# Altium project Brameczki.PrjPcb
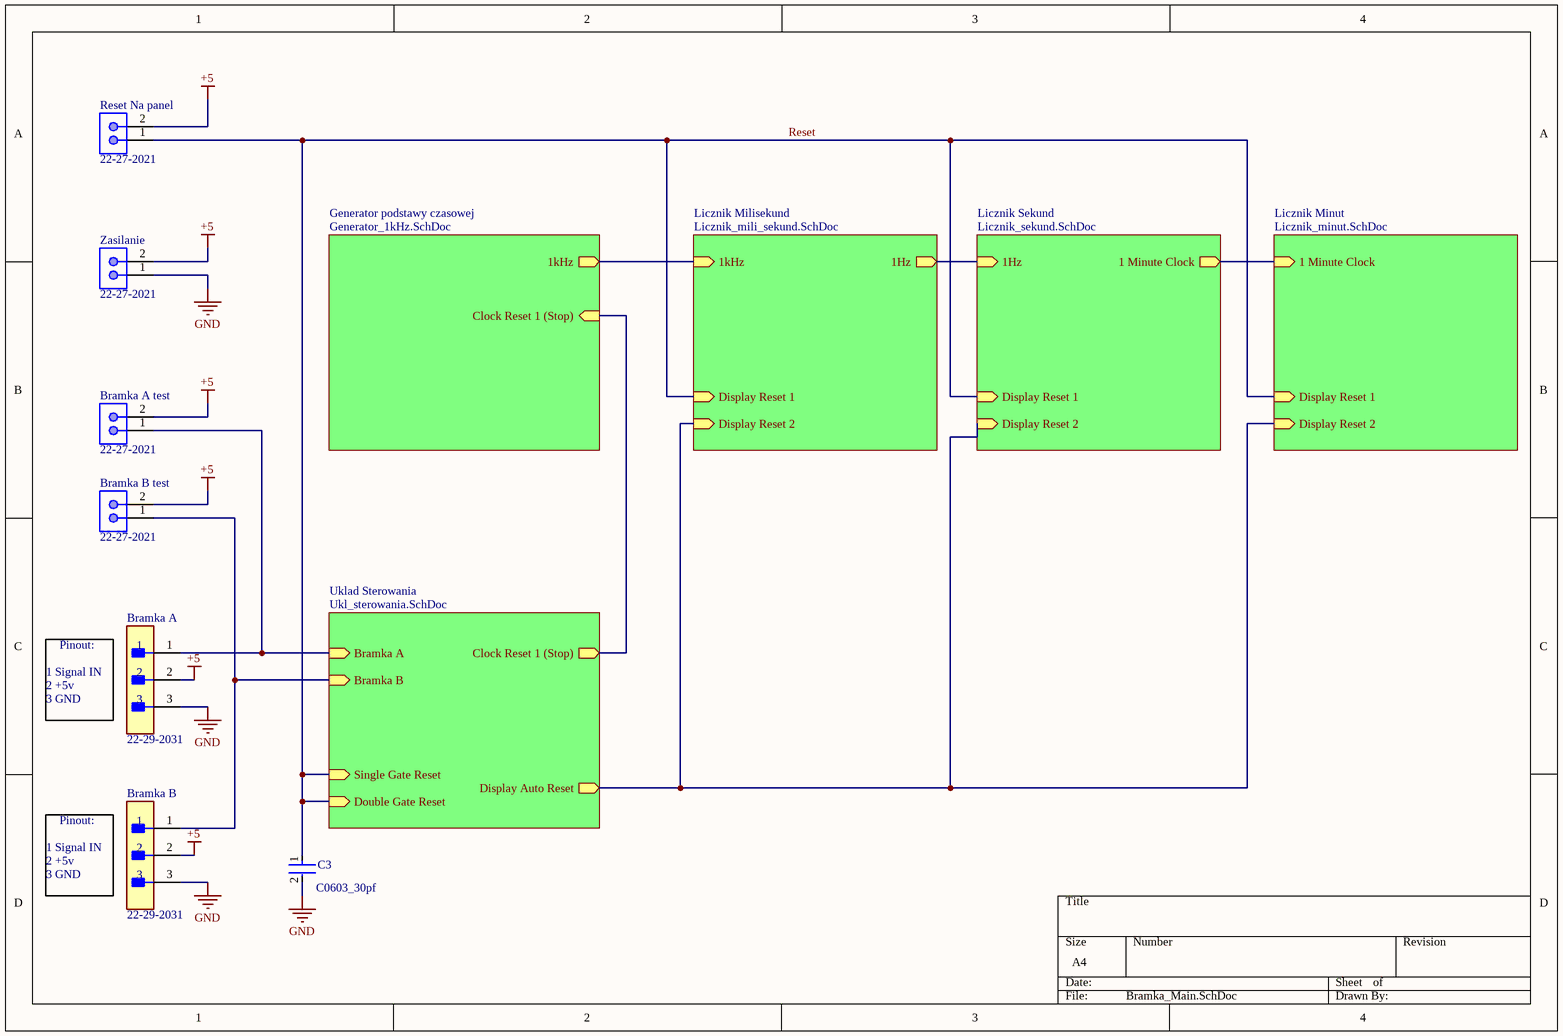
[diagram p0: Bramka_Main.SchDoc]
8 sheets, 135 parts. Net scope: hierarchical (ports join the sheet entries above them; power ports are global).
Board file: Mainboard.PcbDoc
Sheets:
  Bramka_Main.SchDoc
    Generator podstawy czasowej = Generator_1kHz.SchDoc
    Licznik Milisekund = Licznik_mili_sekund.SchDoc
    Licznik Sekund = Licznik_sekund.SchDoc
    Licznik Minut = Licznik_minut.SchDoc
    Uklad Sterowania = Ukl_sterowania.SchDoc
      SR latch = SR.SchDoc
      Uklad rozniczkujacy = Autoreset.SchDoc

## Sheet Bramka_Main.SchDoc
size A4; SheetNumber: 1; SheetTotal: 8

### Parts
Bramka_A  22-29-2031  [FP-22-29-2031-MFG]
Bramka_A_test  22-27-2021  [MOLX-22-27-2021_V]
Bramka_B  22-29-2031  [FP-22-29-2031-MFG]
Bramka_B_test  22-27-2021  [MOLX-22-27-2021_V]
C3  C0603_30pf  [FP-C0603C-CF-MFG]
Reset_Na_panel  22-27-2021  [MOLX-22-27-2021_V]
Zasilanie  22-27-2021  [MOLX-22-27-2021_V]

### Sub-sheets
Generator podstawy czasowej = Generator_1kHz.SchDoc: Clock Reset 1 (Stop) (in), 1kHz (out)
Licznik Milisekund = Licznik_mili_sekund.SchDoc: 1kHz (in), 1Hz (out), Display Reset 1 (in), Display Reset 2 (in)
Licznik Minut = Licznik_minut.SchDoc: 1 Minute Clock (in), Display Reset 1 (in), Display Reset 2 (in)
Licznik Sekund = Licznik_sekund.SchDoc: 1 Minute Clock (out), 1Hz (in), Display Reset 1 (in), Display Reset 2 (in)
Uklad Sterowania = Ukl_sterowania.SchDoc: Bramka A (in), Bramka B (in), Clock Reset 1 (Stop) (out), Single Gate Reset (in), Double Gate Reset (in), Display Auto Reset (out)

### Nets
+5: Bramka_A.2 Bramka_A_test.2 Bramka_B.2 Bramka_B_test.2 Reset_Na_panel.2 Zasilanie.2
GND: Bramka_A.3 Bramka_B.3 C3.2 Zasilanie.1
1Hz: sheet Licznik Milisekund/1Hz, sheet Licznik Sekund/1Hz
Display Reset 2: sheet Licznik Milisekund/Display Reset 2, sheet Licznik Sekund/Display Reset 2, sheet Licznik Minut/Display Reset 2, sheet Uklad Sterowania/Display Auto Reset
Reset: C3.1 Reset_Na_panel.1 ; sheet Licznik Milisekund/Display Reset 1, sheet Licznik Sekund/Display Reset 1, sheet Licznik Minut/Display Reset 1, sheet Uklad Sterowania/Single Gate Reset, sheet Uklad Sterowania/Double Gate Reset  [project net Display Reset 1]
NetBramka_A_1: Bramka_A.1 Bramka_A_test.1 ; sheet Uklad Sterowania/Bramka A
NetBramka_B_1: Bramka_B.1 Bramka_B_test.1 ; sheet Uklad Sterowania/Bramka B
NetD14_1: sheet Generator podstawy czasowej/Clock Reset 1 (Stop), sheet Uklad Sterowania/Clock Reset 1 (Stop)
NetU4_5: sheet Licznik Sekund/1 Minute Clock, sheet Licznik Minut/1 Minute Clock
NetU9_1: sheet Generator podstawy czasowej/1kHz, sheet Licznik Milisekund/1kHz

### Notes on the sheet
- (near Bramka_A) Pinout:
- (near Bramka_A) 1 Signal IN
- 2 +5v
- 3 GND
- (near Bramka_B) 1 Signal IN
- (near Bramka_B) Pinout:

### Library data of the parts
Bramka_A Bramka_B = CMP-04776-000327-1: CONN HEADER VERT 3POS 2.54MM; Contact Resistance: 10mR; Number of Positions: 3; Voltage Rating: 250V; Gender: Male; Connector Type: Male Pin; Current Rating: 4A; Packaging: Bulk; Housing Material: Nylon; Min Operating Temperature: 0°C; Color: Natural; RoHS Compliant: Yes; Housing Color: White; Number of Rows: 1; Pitch: 2.54mm; Mount: Through Hole; Fastening Type: Friction; Length: 7.62mm; Depth: 5.8mm; Contact Material: Brass; Max Operating Temperature: 75°C; Number of Contacts: 3; Contact Type: Male Pin; Working Voltage: 250V; Orientation: Straight; Lead Pitch: 2.54mm; Radiation Hardening: No; Termination: Solder; Contact Plating: Gold; Contact Mating Length: 0.295inch; Series: KK® 6410
Bramka_A_test Bramka_B_test Reset_Na_panel Zasilanie = CMP-2000-05537-1: Male Header, Pitch 2.54 mm, 1 x 2 Position, Height 11.7 mm, Tail Length 3.56 mm, 0 to 75 degC, RoHS, Bulk; Manufacturer: Molex; PartNumber: 0022272021; Current rating: 4A; Package Version: Rev. BC, 02/2012; Voltage rating: 250V; No. of Positions: 2; Pitch: 2.54mm; No. of Rows: 1; Orientation: Vertical; Operating temperature: 0°Cto+75°C; Manufacturer URL: http://www.molex.com/; Mounting Technology: ThroughHole; Housing material: Nylon(UL94V-0); Package Description: 2-Leads Header, Body 5.08 x 5.8 mm, Pitch 2.54 mm; Voltage - Max: 250V; Datasheet URL: http://www.molex.com/pdm_docs/sd/022272021_sd.pdf; Package Reference: 22-27-2021; Contact material: Tinplatedbrass; Current - Max: 4A; Datasheet Version: Rev. F, 06/2009
C3 = CMP-1035-00914-3: CAP CER 30PF 50V 5% NP0 0603; Manufacturer Part Number: C0603C300J5GACTU; Manufacturer: KEMET; Automotive Grade: Grade 1; Temperature Coefficient: 30ppm/°C; Material: Ceramic; Temperature Characteristic: C0G; Tolerance: 0.05; ComponentLink2URL: https://api.kemet.com/component-edge/download/datasheet/C0603C100J5GACAUTO.pdf; Automotive: Yes; Device Class L2: Capacitors; Device Class L1: Passive Components; Device Class L3: Ceramic Capacitors; RoHS: TRUE; Octopart: https://octopart.com/c0603c300j5gactu-kemet-199455; Lead Free: Yes; Value: 30 pF; Temperature Range High: +125°C; Category: Cap; Temperature: -55°C to +125°C; Package: C0603C-CF; Capacitance: 30 pF; Digikey Description: CAP CER 30PF 50V 5% NP0 0603; Height: 0.87mm; ComponentLink2Description: Datasheet; Temperature Range Low: -55°C; Mouser Description: Multilayer Ceramic Capacitors MLCC - SMD/SMT 50volts 30pF C0G 5%; Voltage Rating: 50 V

## Sheet Generator_1kHz.SchDoc
size A4; SheetNumber: 8; SheetTotal: 8; SPICEModelCacheNUSKXPOH: <root> / <DocumentId>NUSKXPOH</DocumentId> / <CacheFrame Number="0"> / <Model Name="xtal" Kind="CKT"> / <Text>*Generic type:crystal pkg:HC33/51 / .SUBCKT XTAL 1 2 PARAMS: FREQ=1Meg RS=750 C=13pf Q=1000 / LX 1 3 {((Q*RS)/(6.2831852*FREQ))} IC=0.5M / CX 3 4 {(1/(Q*6.2831852*FREQ*RS))} / C0 1 2 {C} / RS 4 2 {RS} / .ENDS XTAL</Text> / </Model> / </CacheFrame> / </root>
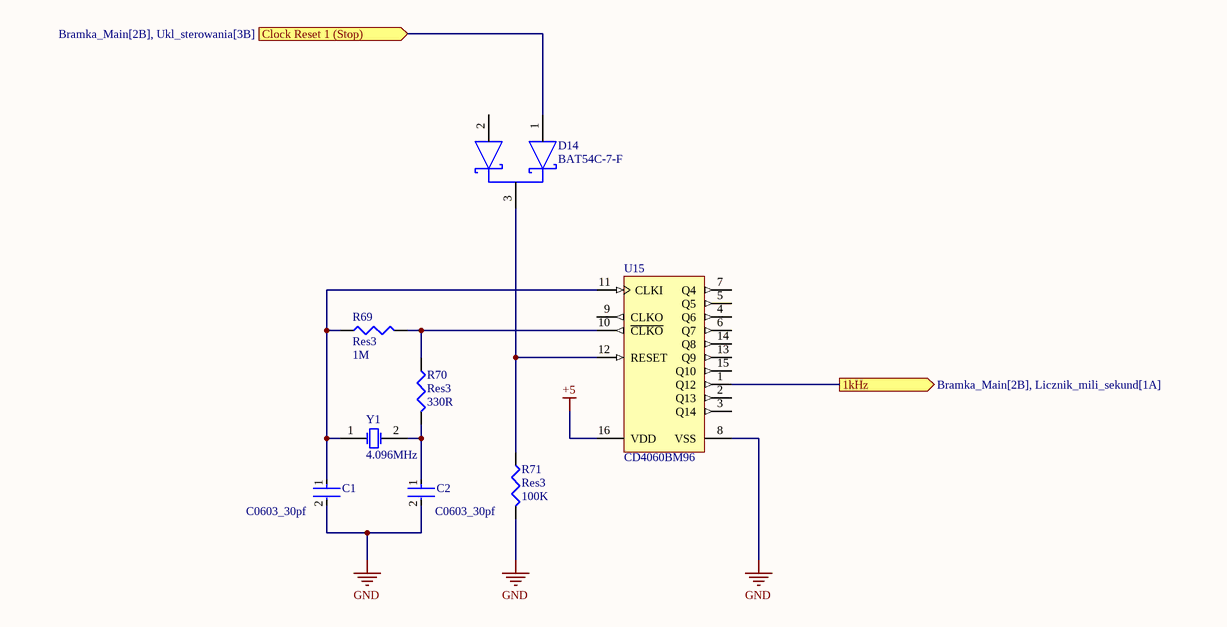
[diagram p1: Generator_1kHz.SchDoc]

### Parts
C1  C0603_30pf  [FP-C0603C-CF-MFG]
C2  C0603_30pf  [FP-C0603C-CF-MFG]
D14  BAT54C-7-F  [FP-SOT23-IPC_B]
R69  Res3  value 1M  [J1-0603]
R70  Res3  value 330R  [J1-0603]
R71  Res3  value 100K  [J1-0603]
U15  CD4060BM96  [D0016A_L]
Y1  4.096MHz  [R38]

### Ports
1kHz (out, see Bramka_Main[2B], Licznik_mili_sekund[1A]), Clock Reset 1 (Stop) (in, see Bramka_Main[2B], Ukl_sterowania[3B])

### Nets
+5: U15.16(VDD)
GND: C1.2 C2.2 R71.2 U15.8(VSS)
NetC1_1: C1.1 R69.1 U15.11(CLKI) Y1.1(OSC1)
NetC2_1: C2.1 R70.2 Y1.2(OSC2)
NetD14_1: D14.1(1_ANODE) ; port Clock Reset 1 (Stop)
NetD14_3: D14.3(COMMON_CATHODE) R71.1 U15.12(RESET)
NetR69_2: R69.2 R70.1 U15.10(~{CLKO})
NetU9_1: U15.1(Q12) ; port 1kHz

Not connected (* = marked no-connect by the designer): D14 2(2_ANODE); U15 2(Q13) 3(Q14) 4(Q6) 5(Q5) 6(Q7) 7(Q4) 9(CLKO) 13(Q9) 14(Q8) 15(Q10)

### Library data of the parts
C1 C2 = CMP-1035-00914-3: as C3 on sheet Bramka_Main; ComponentLink2URL: https://api.kemet.com/component-edge/download/datasheet/C0603C100J5GACAUTO.pdf; Automotive: Yes; Device Class L2: Capacitors; Device Class L1: Passive Components; Device Class L3: Ceramic Capacitors; RoHS: TRUE; Octopart: https://octopart.com/c0603c300j5gactu-kemet-199455; Lead Free: Yes; Value: 30 pF; Temperature Range High: +125°C; Category: Cap; Temperature: -55°C to +125°C; Package: C0603C-CF; Capacitance: 30 pF; Digikey Description: CAP CER 30PF 50V 5% NP0 0603; Height: 0.87mm; ComponentLink2Description: Datasheet; Temperature Range Low: -55°C; Mouser Description: Multilayer Ceramic Capacitors MLCC - SMD/SMT 50volts 30pF C0G 5%; Voltage Rating: 50 V
D14 = CMP-12790-000084-1: DIODE ARRAY SCHOTTKY 30V SOT23-3; Max Reverse Current: 2uA; Power Dissipation: 200mW; Average Rectified Current: 200mA; Capacitance: 10pF; Peak Non-Repetitive Surge Current: 600mA; Forward Voltage: 800mV; Reverse Recovery Time: 5ns; Element Configuration: Common Cathode; Max Operating Temperature: 150°C; Max Reverse Voltage (DC): 30V; Power Rating: 200mW; Termination: SMD/SMT; REACH SVHC: No SVHC; Voltage Rating (DC): 30V; Series: -; Current Rating: 200mA; RoHS Compliant: Yes; Max Power Dissipation: 200mW; Case/Package: SOT-23; Max Repetitive Reverse Voltage (Vrrm): 30V; Width: 1.3mm; Min Operating Temperature: -65°C; Lead Free: Lead Free; Forward Current: 200mA; Number of Pins: 3; Contact Plating: Tin; Package Quantity: 3000; Length: 2.9mm; Radiation Hardening: No; Max Forward Surge Current (Ifsm): 600mA; Height: 1mm; Packaging: Tape and Reel; Mount: Surface Mount; Weight: 0.000282oz
R69-R71 = Res3: Resistor; Published: 8-Jun-2000; LatestRevisionDate: 29-May-2009; LatestRevisionNote: IPC-7351 Footprint Added.; PackageReference: J1-0603; Publisher: Altium Limited; PackageDescription: Chip Resistor
U15 = CMP-1086-00004-4: CMOS 14-Stage Ripple Carry Binary Counter / Divider and Oscillator, 3 to 18 V, -55 to 125 degC, 16-Pin SOIC (D), Green (RoHS & no Sb/Br), Tape and Reel; Manufacturer: Texas Instruments; tPHL, tPLH (typ) @ 5 V: 370 ns; VDD: 3 to 18 V; Mounting Technology: Surface Mount; PackageReference: D0016A; ComponentLink3URL: http://www.ti.com/lit/ml/mpds178g/mpds178g.pdf; ComponentLink3Description: Package Specification; ComponentLink2URL: http://www.ti.com/lit/ds/symlink/cd4060b.pdf; PackageVersion: 4040047-6/M; PackageDescription: 16-Pin Plastic Small-Outline Package, Body 9.9 x 3.9 mm, Pitch 1.27 mm; DatasheetVersion: SCHS049C; PartNumber: CD4060BM96; ComponentLink2Description: Datasheet; Note1: Green (RoHS & no Sb/Br); ComponentLink1Description: Manufacturer URL; Temperature Range: -55 to 125 degC; Packing: Tape and Reel; ComponentLink1URL: http://www.ti.com
Y1 = XTAL: Crystal Oscillator; Published: 8-Jun-2000; LatestRevisionDate: 17-Jul-2002; LatestRevisionNote: Re-released for DXP Platform.; PackageReference: R38; Publisher: Altium Limited; PackageDescription: Crystal, Thru-Hole; 2 Leads; Body 3.1 x 8.2 mm (Dia.xH)

## Sheet Licznik_mili_sekund.SchDoc
size A4; SheetNumber: 7; SheetTotal: 8
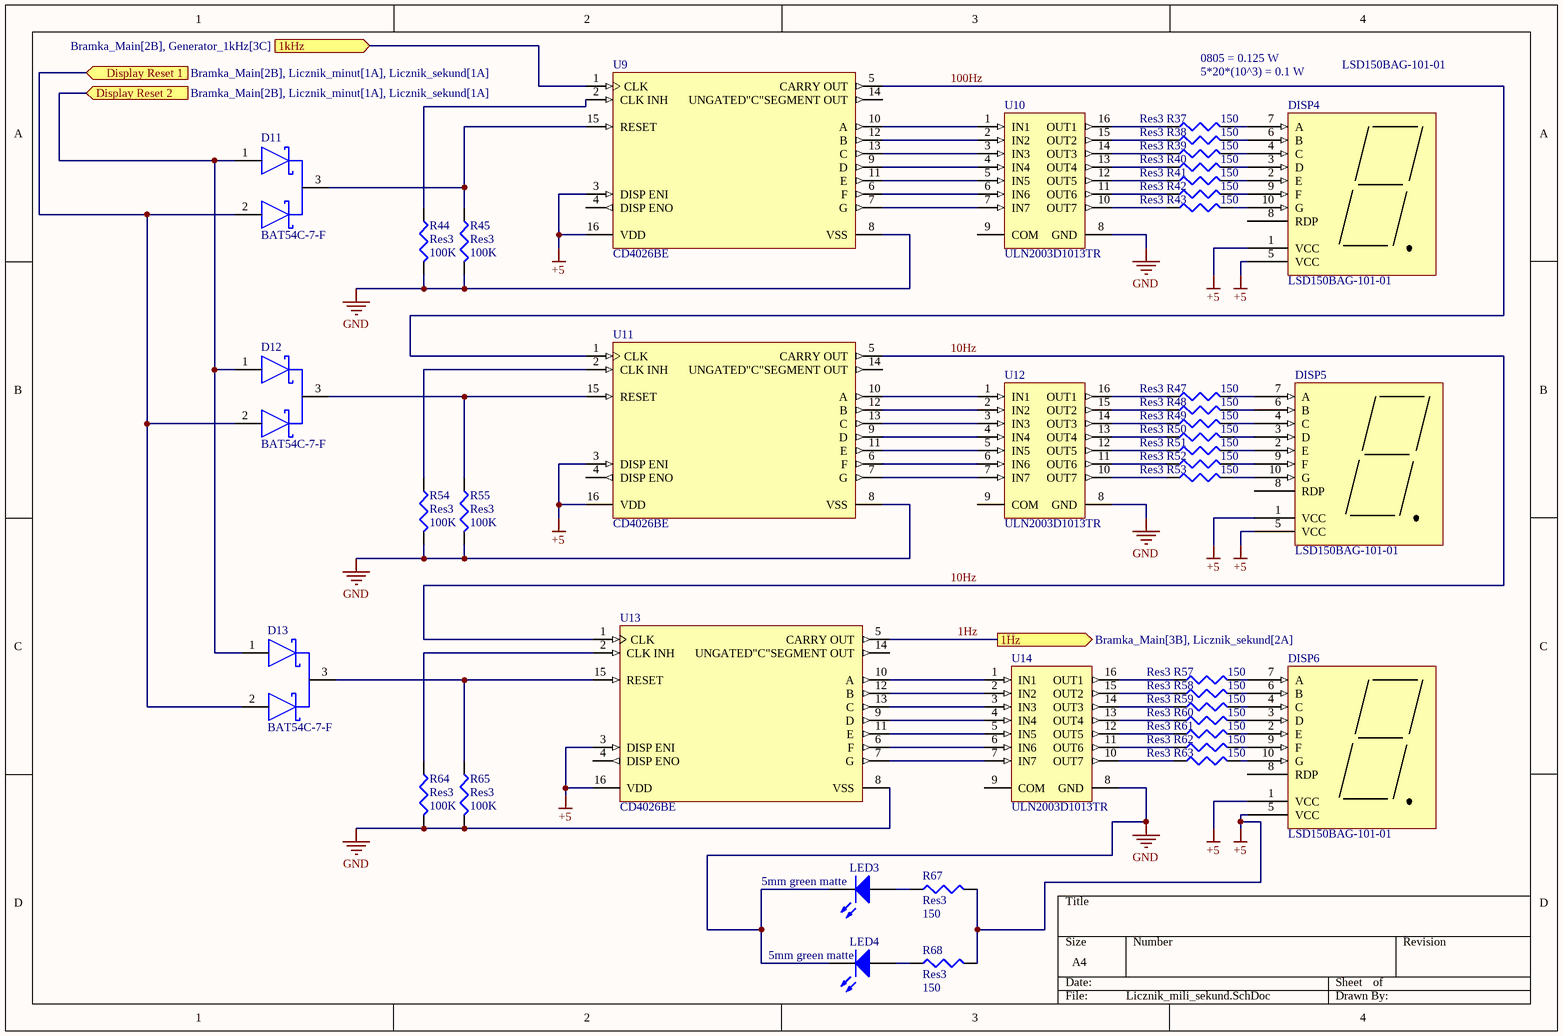
[diagram p2: Licznik_mili_sekund.SchDoc]

### Parts
D11  BAT54C-7-F  [FP-SOT23-IPC_B]
D12  BAT54C-7-F  [FP-SOT23-IPC_B]
D13  BAT54C-7-F  [FP-SOT23-IPC_B]
DISP4  LSD150BAG-101-01  [7 segment display]
DISP5  LSD150BAG-101-01  [7 segment display]
DISP6  LSD150BAG-101-01  [7 segment display]
LED3  5mm green matte  [Type 5mm]
LED4  5mm green matte  [Type 5mm]
R37  Res3  value 150  [6-0805_M]
R38  Res3  value 150  [6-0805_M]
R39  Res3  value 150  [6-0805_M]
R40  Res3  value 150  [6-0805_M]
R41  Res3  value 150  [6-0805_M]
R42  Res3  value 150  [6-0805_M]
R43  Res3  value 150  [6-0805_M]
R44  Res3  value 100K  [J1-0603]
R45  Res3  value 100K  [J1-0603]
R47  Res3  value 150  [6-0805_M]
R48  Res3  value 150  [6-0805_M]
R49  Res3  value 150  [6-0805_M]
R50  Res3  value 150  [6-0805_M]
R51  Res3  value 150  [6-0805_M]
R52  Res3  value 150  [6-0805_M]
R53  Res3  value 150  [6-0805_M]
R54  Res3  value 100K  [J1-0603]
R55  Res3  value 100K  [J1-0603]
R57  Res3  value 150  [6-0805_M]
R58  Res3  value 150  [6-0805_M]
R59  Res3  value 150  [6-0805_M]
R60  Res3  value 150  [6-0805_M]
R61  Res3  value 150  [6-0805_M]
R62  Res3  value 150  [6-0805_M]
R63  Res3  value 150  [6-0805_M]
R64  Res3  value 100K  [J1-0603]
R65  Res3  value 100K  [J1-0603]
R67  Res3  value 150  [6-0805_M]
R68  Res3  value 150  [6-0805_M]
U9  CD4026BE  [N0016A]
U10  ULN2003D1013TR  [STM-SO-16_M]
U11  CD4026BE  [N0016A]
U12  ULN2003D1013TR  [STM-SO-16_M]
U13  CD4026BE  [N0016A]
U14  ULN2003D1013TR  [STM-SO-16_M]

### Ports
1Hz (out, see Bramka_Main[3B], Licznik_sekund[2A]), 1kHz (in, see Bramka_Main[2B], Generator_1kHz[3C]), Display Reset 1 (in, see Bramka_Main[2B], Licznik_minut[1A], Licznik_sekund[1A]), Display Reset 2 (in, see Bramka_Main[2B], Licznik_minut[1A], Licznik_sekund[1A])

### Nets
+5: DISP4.1(VCC) DISP4.5(VCC) DISP5.1(VCC) DISP5.5(VCC) DISP6.1(VCC) DISP6.5(VCC) R67.2 R68.2 U9.3(DISP_ENI) U9.16(VDD) U11.3(DISP_ENI) U11.16(VDD) U13.3(DISP_ENI) U13.16(VDD)
GND: LED3.1(K) LED4.1(K) R44.2 R45.2 R54.2 R55.2 R64.2 R65.2 U9.8(VSS) U10.8(GND) U11.8(VSS) U12.8(GND) U13.8(VSS) U14.8(GND)
1Hz: U13.5(CARRY_OUT) ; port 1Hz
10Hz: U11.5(CARRY_OUT) U13.1(CLK)
100Hz: U9.5(CARRY_OUT) U11.1(CLK)
Display Reset 1: D11.2(2_ANODE) D12.2(2_ANODE) D13.2(2_ANODE) ; port Display Reset 1
Display Reset 2: D11.1(1_ANODE) D12.1(1_ANODE) D13.1(1_ANODE) ; port Display Reset 2
NetD11_3: D11.3(COMMON_CATHODE) R45.1 U9.15(RESET)
NetD12_3: D12.3(COMMON_CATHODE) R55.1 U11.15(RESET)
NetD13_3: D13.3(COMMON_CATHODE) R65.1 U13.15(RESET)
NetDISP4_2: DISP4.2(E) R41.2
NetDISP4_3: DISP4.3(D) R40.2
NetDISP4_4: DISP4.4(C) R39.2
NetDISP4_6: DISP4.6(B) R38.2
NetDISP4_7: DISP4.7(A) R37.2
NetDISP4_9: DISP4.9(F) R42.2
NetDISP4_10: DISP4.10(G) R43.2
NetDISP5_2: DISP5.2(E) R51.2
NetDISP5_3: DISP5.3(D) R50.2
NetDISP5_4: DISP5.4(C) R49.2
NetDISP5_6: DISP5.6(B) R48.2
NetDISP5_7: DISP5.7(A) R47.2
NetDISP5_9: DISP5.9(F) R52.2
NetDISP5_10: DISP5.10(G) R53.2
NetDISP6_2: DISP6.2(E) R61.2
NetDISP6_3: DISP6.3(D) R60.2
NetDISP6_4: DISP6.4(C) R59.2
NetDISP6_6: DISP6.6(B) R58.2
NetDISP6_7: DISP6.7(A) R57.2
NetDISP6_9: DISP6.9(F) R62.2
NetDISP6_10: DISP6.10(G) R63.2
NetLED3_2: LED3.2(A) R67.1
NetLED4_2: LED4.2(A) R68.1
NetR37_1: R37.1 U10.16(OUT1)
NetR38_1: R38.1 U10.15(OUT2)
NetR39_1: R39.1 U10.14(OUT3)
NetR40_1: R40.1 U10.13(OUT4)
NetR41_1: R41.1 U10.12(OUT5)
NetR42_1: R42.1 U10.11(OUT6)
NetR43_1: R43.1 U10.10(OUT7)
NetR44_1: R44.1 U9.2(CLK_INH)
NetR47_1: R47.1 U12.16(OUT1)
NetR48_1: R48.1 U12.15(OUT2)
NetR49_1: R49.1 U12.14(OUT3)
NetR50_1: R50.1 U12.13(OUT4)
NetR51_1: R51.1 U12.12(OUT5)
NetR52_1: R52.1 U12.11(OUT6)
NetR53_1: R53.1 U12.10(OUT7)
NetR54_1: R54.1 U11.2(CLK_INH)
NetR57_1: R57.1 U14.16(OUT1)
NetR58_1: R58.1 U14.15(OUT2)
NetR59_1: R59.1 U14.14(OUT3)
NetR60_1: R60.1 U14.13(OUT4)
NetR61_1: R61.1 U14.12(OUT5)
NetR62_1: R62.1 U14.11(OUT6)
NetR63_1: R63.1 U14.10(OUT7)
NetR64_1: R64.1 U13.2(CLK_INH)
NetU9_1: U9.1(CLK) ; port 1kHz
NetU9_6: U9.6(F) U10.6(IN6)
NetU9_7: U9.7(G) U10.7(IN7)
NetU9_9: U9.9(D) U10.4(IN4)
NetU9_10: U9.10(A) U10.1(IN1)
NetU9_11: U9.11(E) U10.5(IN5)
NetU9_12: U9.12(B) U10.2(IN2)
NetU9_13: U9.13(C) U10.3(IN3)
NetU11_6: U11.6(F) U12.6(IN6)
NetU11_7: U11.7(G) U12.7(IN7)
NetU11_9: U11.9(D) U12.4(IN4)
NetU11_10: U11.10(A) U12.1(IN1)
NetU11_11: U11.11(E) U12.5(IN5)
NetU11_12: U11.12(B) U12.2(IN2)
NetU11_13: U11.13(C) U12.3(IN3)
NetU13_6: U13.6(F) U14.6(IN6)
NetU13_7: U13.7(G) U14.7(IN7)
NetU13_9: U13.9(D) U14.4(IN4)
NetU13_10: U13.10(A) U14.1(IN1)
NetU13_11: U13.11(E) U14.5(IN5)
NetU13_12: U13.12(B) U14.2(IN2)
NetU13_13: U13.13(C) U14.3(IN3)

Not connected (* = marked no-connect by the designer): DISP4 8(RDP); DISP5 8(RDP); DISP6 8(RDP); U9 4(DISP_ENO) 14(UNGATED"C"SEGMENT_OUT); U10 9(COM); U11 4(DISP_ENO) 14(UNGATED"C"SEGMENT_OUT); U12 9(COM); U13 4(DISP_ENO) 14(UNGATED"C"SEGMENT_OUT); U14 9(COM)

### Notes on the sheet
- 5*20*(10^3) = 0.1 W
- 0805 = 0.125 W
- LSD150BAG-101-01

### Library data of the parts
D11-D13 = CMP-12790-000084-1: as D14 on sheet Generator_1kHz; Max Operating Temperature: 150°C; Max Reverse Voltage (DC): 30V; Power Rating: 200mW; Termination: SMD/SMT; REACH SVHC: No SVHC; Voltage Rating (DC): 30V; Series: -; Current Rating: 200mA; RoHS Compliant: Yes; Max Power Dissipation: 200mW; Case/Package: SOT-23; Max Repetitive Reverse Voltage (Vrrm): 30V; Width: 1.3mm; Min Operating Temperature: -65°C; Lead Free: Lead Free; Forward Current: 200mA; Number of Pins: 3; Contact Plating: Tin; Package Quantity: 3000; Length: 2.9mm; Radiation Hardening: No; Max Forward Surge Current (Ifsm): 600mA; Height: 1mm; Packaging: Tape and Reel; Mount: Surface Mount; Weight: 0.000282oz
DISP4-DISP6 = CMP-007-00036-2: 7 segment display 1.5 inch
LED3 LED4 = CMP-1488-00007-1: THT LED round mono-color color lens, WL-TMRW, Bright Green; PartNumber: 151051VS04000; Manufacturer: Wuerth Elektronik; Emitting color: Bright Green; ComponentLink1Description: Manufacturer URL; PackageReference: Type 5mm; ComponentLink2URL: http://katalog.we-online.de/pbs/datasheet/7448042001.pdfhttp://katalog.we-online.de/pbs/datasheet/7448042001.pdfhttp://katalog.we-online.de/pbs/datasheet/7448042001.pdfhttp://katalog.we-online.de/pbs/datasheet/151051VS04000.pdf; ComponentLink1URL: http://www.we-online.com; ComponentLink2Description: Datasheet
R37-R45 R47-R55 R57-R65 R67 R68 = Res3: Resistor; Published: 8-Jun-2000; LatestRevisionDate: 29-May-2009; LatestRevisionNote: IPC-7351 Footprint Added.; PackageReference: J1-0603; Publisher: Altium Limited; PackageDescription: Chip Resistor
U9 U11 U13 = CMP-1623-00561-2: CMOS Decade Counter/Divider with Decoded 7-Segment Display Outputs and Display Enable, N0016A, TUBE; Manufacturer: Texas Instruments; ICC @ Nom Voltage(Max)(mA): 0.03; tpd @ Nom Voltage(Max)(ns): 250; F @ Nom Voltage(Max)(Mhz): 8; Bits(#): 7; VCC(Max)(V): 18; VCC(Min)(V): 3; Output Drive (IOL/IOH)(Max)(mA): 1.5/-1.5; Inputs: 1; Rating: Catalog; Technology Family: CD4000; Schmitt Trigger: No; Voltage(Nom)(V): 5,10,15; DatasheetVersion: SCHS031B; Operating Temperature Range(C): -55 to 125; Code_JEDEC: MS-001; Input Type: CMOS; Output Type: CMOS; Type: Decade; Generic Part Number: CD4026B; PackageReference: N0016A; Function: Counter
U10 U12 U14 = CMP-2000-05374-1: Seven NPN Darlington Array Transistor, 50 V, 500 mA, -40 to 85 degC, 8-Pin SOIC, RoHS, Tape and Reel; Manufacturer: STMicroelectronics; Collector Emitter Voltage V(br)ceo: 50V; SVHC: NoSVHC(17-Dec-2015); DC Current Gain hFE: 1000hFE; DC Collector Current: 500mA; No. of Pins: 16Pins; Package Reference: SO-16; Transistor Polarity: NPN; Transistor Case Style: SOIC; Datasheet URL: https://datasheet.ciiva.com/1193/1690348-1193460.pdf; Package Description: 16-Pin Small Outline Integrated Circuit, Body 9.9 x 3.9 mm, Pitch 1.27 mm; Datasheet Version: Rev. 8, 06/2012; Power Dissipation Pd: -; Product Range: -; Operating Temperature Max: 85degC; MSL: MSL1-Unlimited; Manufacturer URL: http://www.st.com/; Automotive Qualification Standard: -

## Sheet Licznik_sekund.SchDoc
size A4; SheetNumber: 2; SheetTotal: 8
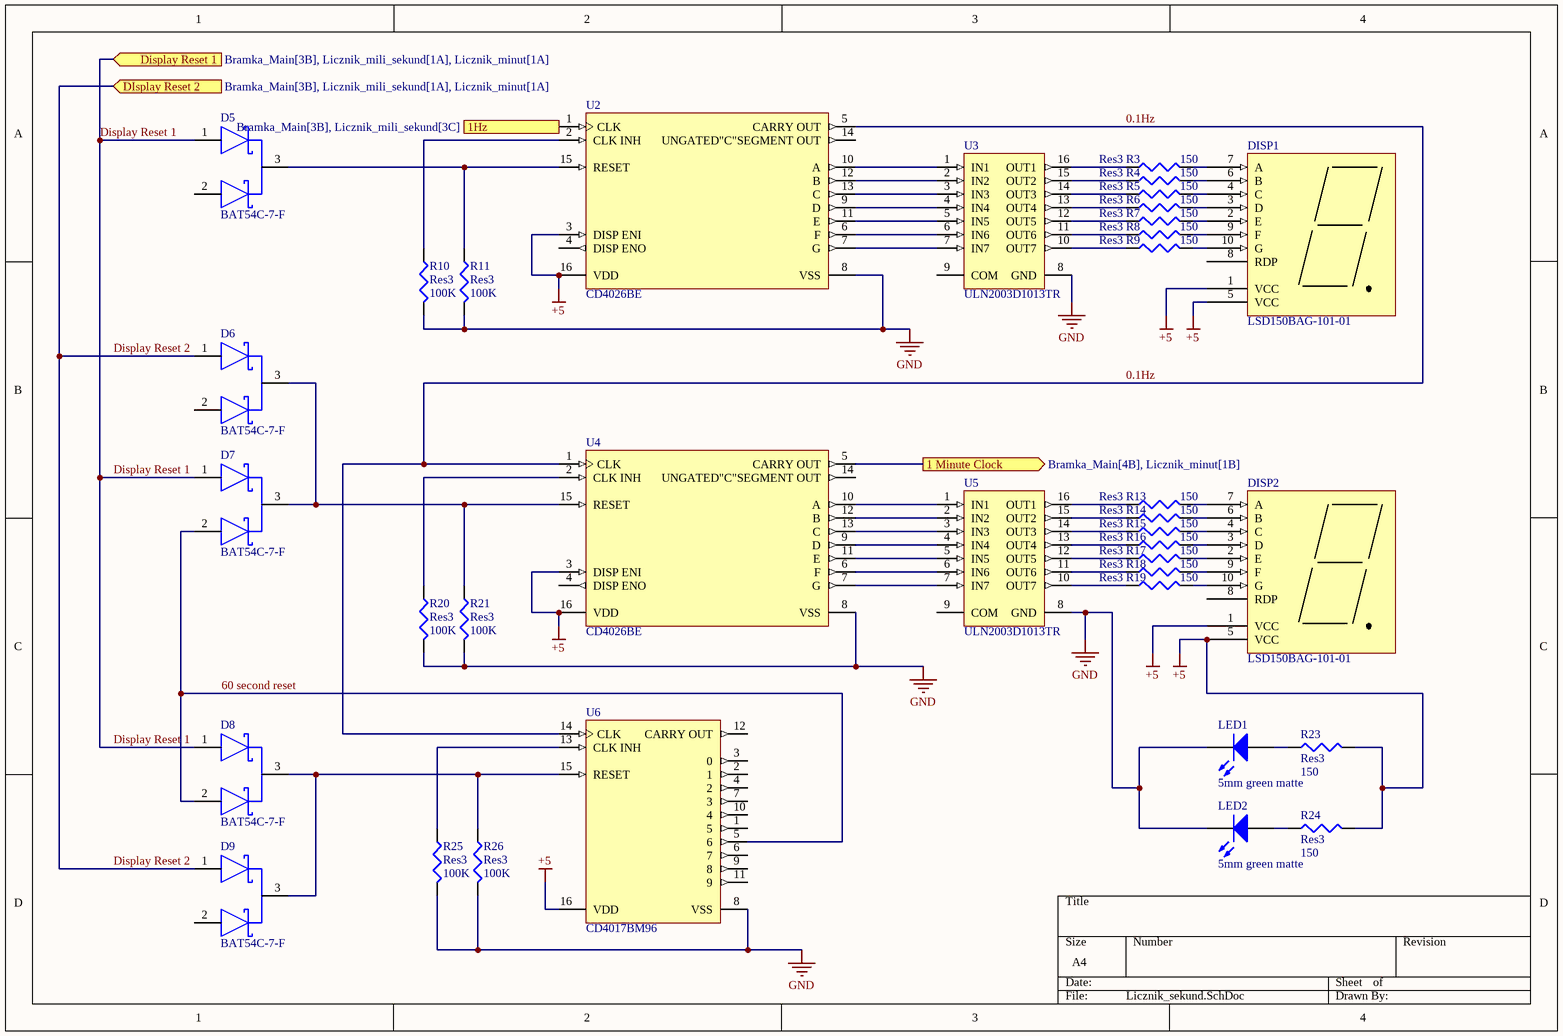
[diagram p3: Licznik_sekund.SchDoc]

### Parts
D5  BAT54C-7-F  [FP-SOT23-IPC_B]
D6  BAT54C-7-F  [FP-SOT23-IPC_B]
D7  BAT54C-7-F  [FP-SOT23-IPC_B]
D8  BAT54C-7-F  [FP-SOT23-IPC_B]
D9  BAT54C-7-F  [FP-SOT23-IPC_B]
DISP1  LSD150BAG-101-01  [7 segment display]
DISP2  LSD150BAG-101-01  [7 segment display]
LED1  5mm green matte  [Type 5mm]
LED2  5mm green matte  [Type 5mm]
R3  Res3  value 150  [6-0805_M]
R4  Res3  value 150  [6-0805_M]
R5  Res3  value 150  [6-0805_M]
R6  Res3  value 150  [6-0805_M]
R7  Res3  value 150  [6-0805_M]
R8  Res3  value 150  [6-0805_M]
R9  Res3  value 150  [6-0805_M]
R10  Res3  value 100K  [J1-0603]
R11  Res3  value 100K  [J1-0603]
R13  Res3  value 150  [6-0805_M]
R14  Res3  value 150  [6-0805_M]
R15  Res3  value 150  [6-0805_M]
R16  Res3  value 150  [6-0805_M]
R17  Res3  value 150  [6-0805_M]
R18  Res3  value 150  [6-0805_M]
R19  Res3  value 150  [6-0805_M]
R20  Res3  value 100K  [J1-0603]
R21  Res3  value 100K  [J1-0603]
R23  Res3  value 150  [6-0805_M]
R24  Res3  value 150  [6-0805_M]
R25  Res3  value 100K  [J1-0603]
R26  Res3  value 100K  [J1-0603]
U2  CD4026BE  [N0016A]
U3  ULN2003D1013TR  [STM-SO-16_M]
U4  CD4026BE  [N0016A]
U5  ULN2003D1013TR  [STM-SO-16_M]
U6  CD4017BM96  [D0016A_L]

### Ports
1 Minute Clock (out, see Bramka_Main[4B], Licznik_minut[1B]), 1Hz (in, see Bramka_Main[3B], Licznik_mili_sekund[3C]), Display Reset 1 (in, see Bramka_Main[3B], Licznik_mili_sekund[1A], Licznik_minut[1A]), DIsplay Reset 2 (in, see Bramka_Main[3B], Licznik_mili_sekund[1A], Licznik_minut[1A])

### Nets
+5: DISP1.1(VCC) DISP1.5(VCC) DISP2.1(VCC) DISP2.5(VCC) R23.2 R24.2 U2.3(DISP_ENI) U2.16(VDD) U4.3(DISP_ENI) U4.16(VDD) U6.16(VDD)
GND: LED1.1(K) LED2.1(K) R10.2 R11.2 R20.2 R21.2 R25.2 R26.2 U2.8(VSS) U3.8(GND) U4.8(VSS) U5.8(GND) U6.8(VSS)
0.1Hz: U2.5(CARRY_OUT) U4.1(CLK) U6.14(CLK)
1Hz: U2.1(CLK) ; port 1Hz
60 second reset: D7.2(2_ANODE) D8.2(2_ANODE) U6.5(6)
Display Reset 1: D5.1(1_ANODE) D7.1(1_ANODE) D8.1(1_ANODE) ; port Display Reset 1
Display Reset 2: D6.1(1_ANODE) D9.1(1_ANODE) ; port DIsplay Reset 2
NetD5_3: D5.3(COMMON_CATHODE) R11.1 U2.15(RESET)
NetD6_3: D6.3(COMMON_CATHODE) D7.3(COMMON_CATHODE) R21.1 U4.15(RESET)
NetD8_3: D8.3(COMMON_CATHODE) D9.3(COMMON_CATHODE) R26.1 U6.15(RESET)
NetDISP1_2: DISP1.2(E) R7.2
NetDISP1_3: DISP1.3(D) R6.2
NetDISP1_4: DISP1.4(C) R5.2
NetDISP1_6: DISP1.6(B) R4.2
NetDISP1_7: DISP1.7(A) R3.2
NetDISP1_9: DISP1.9(F) R8.2
NetDISP1_10: DISP1.10(G) R9.2
NetDISP2_2: DISP2.2(E) R17.2
NetDISP2_3: DISP2.3(D) R16.2
NetDISP2_4: DISP2.4(C) R15.2
NetDISP2_6: DISP2.6(B) R14.2
NetDISP2_7: DISP2.7(A) R13.2
NetDISP2_9: DISP2.9(F) R18.2
NetDISP2_10: DISP2.10(G) R19.2
NetLED1_2: LED1.2(A) R23.1
NetLED2_2: LED2.2(A) R24.1
NetR3_1: R3.1 U3.16(OUT1)
NetR4_1: R4.1 U3.15(OUT2)
NetR5_1: R5.1 U3.14(OUT3)
NetR6_1: R6.1 U3.13(OUT4)
NetR7_1: R7.1 U3.12(OUT5)
NetR8_1: R8.1 U3.11(OUT6)
NetR9_1: R9.1 U3.10(OUT7)
NetR10_1: R10.1 U2.2(CLK_INH)
NetR13_1: R13.1 U5.16(OUT1)
NetR14_1: R14.1 U5.15(OUT2)
NetR15_1: R15.1 U5.14(OUT3)
NetR16_1: R16.1 U5.13(OUT4)
NetR17_1: R17.1 U5.12(OUT5)
NetR18_1: R18.1 U5.11(OUT6)
NetR19_1: R19.1 U5.10(OUT7)
NetR20_1: R20.1 U4.2(CLK_INH)
NetR25_1: R25.1 U6.13(CLK_INH)
NetU2_6: U2.6(F) U3.6(IN6)
NetU2_7: U2.7(G) U3.7(IN7)
NetU2_9: U2.9(D) U3.4(IN4)
NetU2_10: U2.10(A) U3.1(IN1)
NetU2_11: U2.11(E) U3.5(IN5)
NetU2_12: U2.12(B) U3.2(IN2)
NetU2_13: U2.13(C) U3.3(IN3)
NetU4_5: U4.5(CARRY_OUT) ; port 1 Minute Clock
NetU4_6: U4.6(F) U5.6(IN6)
NetU4_7: U4.7(G) U5.7(IN7)
NetU4_9: U4.9(D) U5.4(IN4)
NetU4_10: U4.10(A) U5.1(IN1)
NetU4_11: U4.11(E) U5.5(IN5)
NetU4_12: U4.12(B) U5.2(IN2)
NetU4_13: U4.13(C) U5.3(IN3)

Not connected (* = marked no-connect by the designer): D5 2(2_ANODE); D6 2(2_ANODE); D9 2(2_ANODE); DISP1 8(RDP); DISP2 8(RDP); U2 4(DISP_ENO) 14(UNGATED"C"SEGMENT_OUT); U3 9(COM); U4 4(DISP_ENO) 14(UNGATED"C"SEGMENT_OUT); U5 9(COM); U6 1(5) 2(1) 3(0) 4(2) 6(7) 7(3) 9(8) 10(4) 11(9) 12(CARRY_OUT)

### Library data of the parts
D5-D9 = CMP-12790-000084-1: as D14 on sheet Generator_1kHz; Max Operating Temperature: 150°C; Max Reverse Voltage (DC): 30V; Power Rating: 200mW; Termination: SMD/SMT; REACH SVHC: No SVHC; Voltage Rating (DC): 30V; Series: -; Current Rating: 200mA; RoHS Compliant: Yes; Max Power Dissipation: 200mW; Case/Package: SOT-23; Max Repetitive Reverse Voltage (Vrrm): 30V; Width: 1.3mm; Min Operating Temperature: -65°C; Lead Free: Lead Free; Forward Current: 200mA; Number of Pins: 3; Contact Plating: Tin; Package Quantity: 3000; Length: 2.9mm; Radiation Hardening: No; Max Forward Surge Current (Ifsm): 600mA; Height: 1mm; Packaging: Tape and Reel; Mount: Surface Mount; Weight: 0.000282oz
DISP1 DISP2 = CMP-007-00036-2: 7 segment display 1.5 inch
LED1 LED2 = CMP-1488-00007-1: as LED3 on sheet Licznik_mili_sekund; Emitting color: Bright Green; ComponentLink1Description: Manufacturer URL; PackageReference: Type 5mm; ComponentLink2URL: http://katalog.we-online.de/pbs/datasheet/7448042001.pdfhttp://katalog.we-online.de/pbs/datasheet/7448042001.pdfhttp://katalog.we-online.de/pbs/datasheet/7448042001.pdfhttp://katalog.we-online.de/pbs/datasheet/151051VS04000.pdf; ComponentLink1URL: http://www.we-online.com; ComponentLink2Description: Datasheet
R3-R11 R13-R21 R23-R26 = Res3: Resistor; Published: 8-Jun-2000; LatestRevisionDate: 29-May-2009; LatestRevisionNote: IPC-7351 Footprint Added.; PackageReference: J1-0603; Publisher: Altium Limited; PackageDescription: Chip Resistor
U2 U4 = CMP-1623-00561-2: as U9 on sheet Licznik_mili_sekund; DatasheetVersion: SCHS031B; Operating Temperature Range(C): -55 to 125; Code_JEDEC: MS-001; Input Type: CMOS; Output Type: CMOS; Type: Decade; Generic Part Number: CD4026B; PackageReference: N0016A; Function: Counter
U3 U5 = CMP-2000-05374-1: as U10 on sheet Licznik_mili_sekund; Package Reference: SO-16; Transistor Polarity: NPN; Transistor Case Style: SOIC; Datasheet URL: https://datasheet.ciiva.com/1193/1690348-1193460.pdf; Package Description: 16-Pin Small Outline Integrated Circuit, Body 9.9 x 3.9 mm, Pitch 1.27 mm; Datasheet Version: Rev. 8, 06/2012; Power Dissipation Pd: -; Product Range: -; Operating Temperature Max: 85degC; MSL: MSL1-Unlimited; Manufacturer URL: http://www.st.com/; Automotive Qualification Standard: -
U6 = CMP-1623-00072-2: CMOS Decade Counter with 10 Decoded Outputs, D0016A, LARGE T&R; Manufacturer: Texas Instruments; Technology Family: CD4000; Schmitt Trigger: No; VCC(Max)(V): 18; Inputs: 1; tpd @ Nom Voltage(Max)(ns): 270; Rating: Military; Bits(#): 10; Output Drive (IOL/IOH)(Max)(mA): 1.5/-1.5; ICC @ Nom Voltage(Max)(mA): 0.03; F @ Nom Voltage(Max)(Mhz): 8; VCC(Min)(V): 3; Output Type: CMOS; Operating Temperature Range(C): -55 to 125; Generic Part Number: CD4017B; Type: Decade; DatasheetVersion: SCHS027C; Input Type: CMOS; Function: Counter; PackageReference: D0016A; Code_JEDEC: MS-012 variation AC; Voltage(Nom)(V): 10

## Sheet Licznik_minut.SchDoc
size A4; SheetNumber: 3; SheetTotal: 8
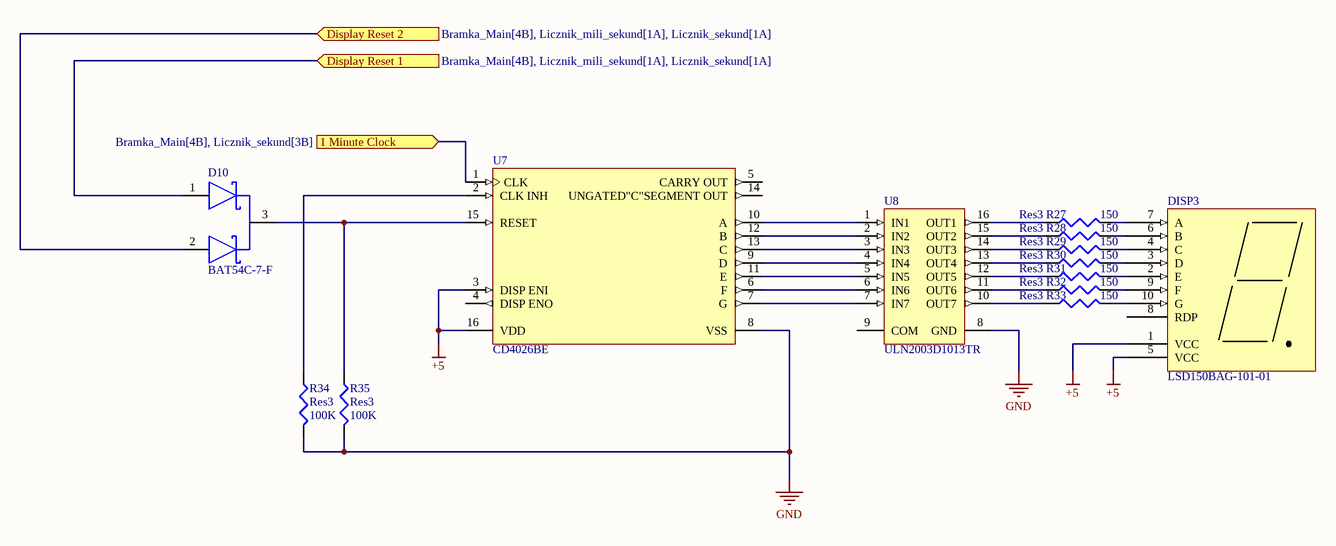
[diagram p4: Licznik_minut.SchDoc]

### Parts
D10  BAT54C-7-F  [FP-SOT23-IPC_B]
DISP3  LSD150BAG-101-01  [7 segment display]
R27  Res3  value 150  [6-0805_M]
R28  Res3  value 150  [6-0805_M]
R29  Res3  value 150  [6-0805_M]
R30  Res3  value 150  [6-0805_M]
R31  Res3  value 150  [6-0805_M]
R32  Res3  value 150  [6-0805_M]
R33  Res3  value 150  [6-0805_M]
R34  Res3  value 100K  [J1-0603]
R35  Res3  value 100K  [J1-0603]
U7  CD4026BE  [N0016A]
U8  ULN2003D1013TR  [STM-SO-16_M]

### Ports
1 Minute Clock (in, see Bramka_Main[4B], Licznik_sekund[3B]), Display Reset 1 (in, see Bramka_Main[4B], Licznik_mili_sekund[1A], Licznik_sekund[1A]), Display Reset 2 (in, see Bramka_Main[4B], Licznik_mili_sekund[1A], Licznik_sekund[1A])

### Nets
+5: DISP3.1(VCC) DISP3.5(VCC) U7.3(DISP_ENI) U7.16(VDD)
GND: R34.2 R35.2 U7.8(VSS) U8.8(GND)
Display Reset 1: D10.1(1_ANODE) ; port Display Reset 1
Display Reset 2: D10.2(2_ANODE) ; port Display Reset 2
NetD10_3: D10.3(COMMON_CATHODE) R35.1 U7.15(RESET)
NetDISP3_2: DISP3.2(E) R31.2
NetDISP3_3: DISP3.3(D) R30.2
NetDISP3_4: DISP3.4(C) R29.2
NetDISP3_6: DISP3.6(B) R28.2
NetDISP3_7: DISP3.7(A) R27.2
NetDISP3_9: DISP3.9(F) R32.2
NetDISP3_10: DISP3.10(G) R33.2
NetR27_1: R27.1 U8.16(OUT1)
NetR28_1: R28.1 U8.15(OUT2)
NetR29_1: R29.1 U8.14(OUT3)
NetR30_1: R30.1 U8.13(OUT4)
NetR31_1: R31.1 U8.12(OUT5)
NetR32_1: R32.1 U8.11(OUT6)
NetR33_1: R33.1 U8.10(OUT7)
NetR34_1: R34.1 U7.2(CLK_INH)
NetU4_5: U7.1(CLK) ; port 1 Minute Clock
NetU7_6: U7.6(F) U8.6(IN6)
NetU7_7: U7.7(G) U8.7(IN7)
NetU7_9: U7.9(D) U8.4(IN4)
NetU7_10: U7.10(A) U8.1(IN1)
NetU7_11: U7.11(E) U8.5(IN5)
NetU7_12: U7.12(B) U8.2(IN2)
NetU7_13: U7.13(C) U8.3(IN3)

Not connected (* = marked no-connect by the designer): DISP3 8(RDP); U7 4(DISP_ENO) 5(CARRY_OUT) 14(UNGATED"C"SEGMENT_OUT); U8 9(COM)

### Library data of the parts
D10 = CMP-12790-000084-1: as D14 on sheet Generator_1kHz; Max Operating Temperature: 150°C; Max Reverse Voltage (DC): 30V; Power Rating: 200mW; Termination: SMD/SMT; REACH SVHC: No SVHC; Voltage Rating (DC): 30V; Series: -; Current Rating: 200mA; RoHS Compliant: Yes; Max Power Dissipation: 200mW; Case/Package: SOT-23; Max Repetitive Reverse Voltage (Vrrm): 30V; Width: 1.3mm; Min Operating Temperature: -65°C; Lead Free: Lead Free; Forward Current: 200mA; Number of Pins: 3; Contact Plating: Tin; Package Quantity: 3000; Length: 2.9mm; Radiation Hardening: No; Max Forward Surge Current (Ifsm): 600mA; Height: 1mm; Packaging: Tape and Reel; Mount: Surface Mount; Weight: 0.000282oz
DISP3 = CMP-007-00036-2: 7 segment display 1.5 inch
R27-R35 = Res3: Resistor; Published: 8-Jun-2000; LatestRevisionDate: 29-May-2009; LatestRevisionNote: IPC-7351 Footprint Added.; PackageReference: J1-0603; Publisher: Altium Limited; PackageDescription: Chip Resistor
U7 = CMP-1623-00561-2: as U9 on sheet Licznik_mili_sekund; DatasheetVersion: SCHS031B; Operating Temperature Range(C): -55 to 125; Code_JEDEC: MS-001; Input Type: CMOS; Output Type: CMOS; Type: Decade; Generic Part Number: CD4026B; PackageReference: N0016A; Function: Counter
U8 = CMP-2000-05374-1: as U10 on sheet Licznik_mili_sekund; Package Reference: SO-16; Transistor Polarity: NPN; Transistor Case Style: SOIC; Datasheet URL: https://datasheet.ciiva.com/1193/1690348-1193460.pdf; Package Description: 16-Pin Small Outline Integrated Circuit, Body 9.9 x 3.9 mm, Pitch 1.27 mm; Datasheet Version: Rev. 8, 06/2012; Power Dissipation Pd: -; Product Range: -; Operating Temperature Max: 85degC; MSL: MSL1-Unlimited; Manufacturer URL: http://www.st.com/; Automotive Qualification Standard: -

## Sheet Ukl_sterowania.SchDoc
size A4; SheetNumber: 4; SheetTotal: 8; SPICEModelCacheXNHIIHBZ: <root> / <DocumentId>XNHIIHBZ</DocumentId> / </root>
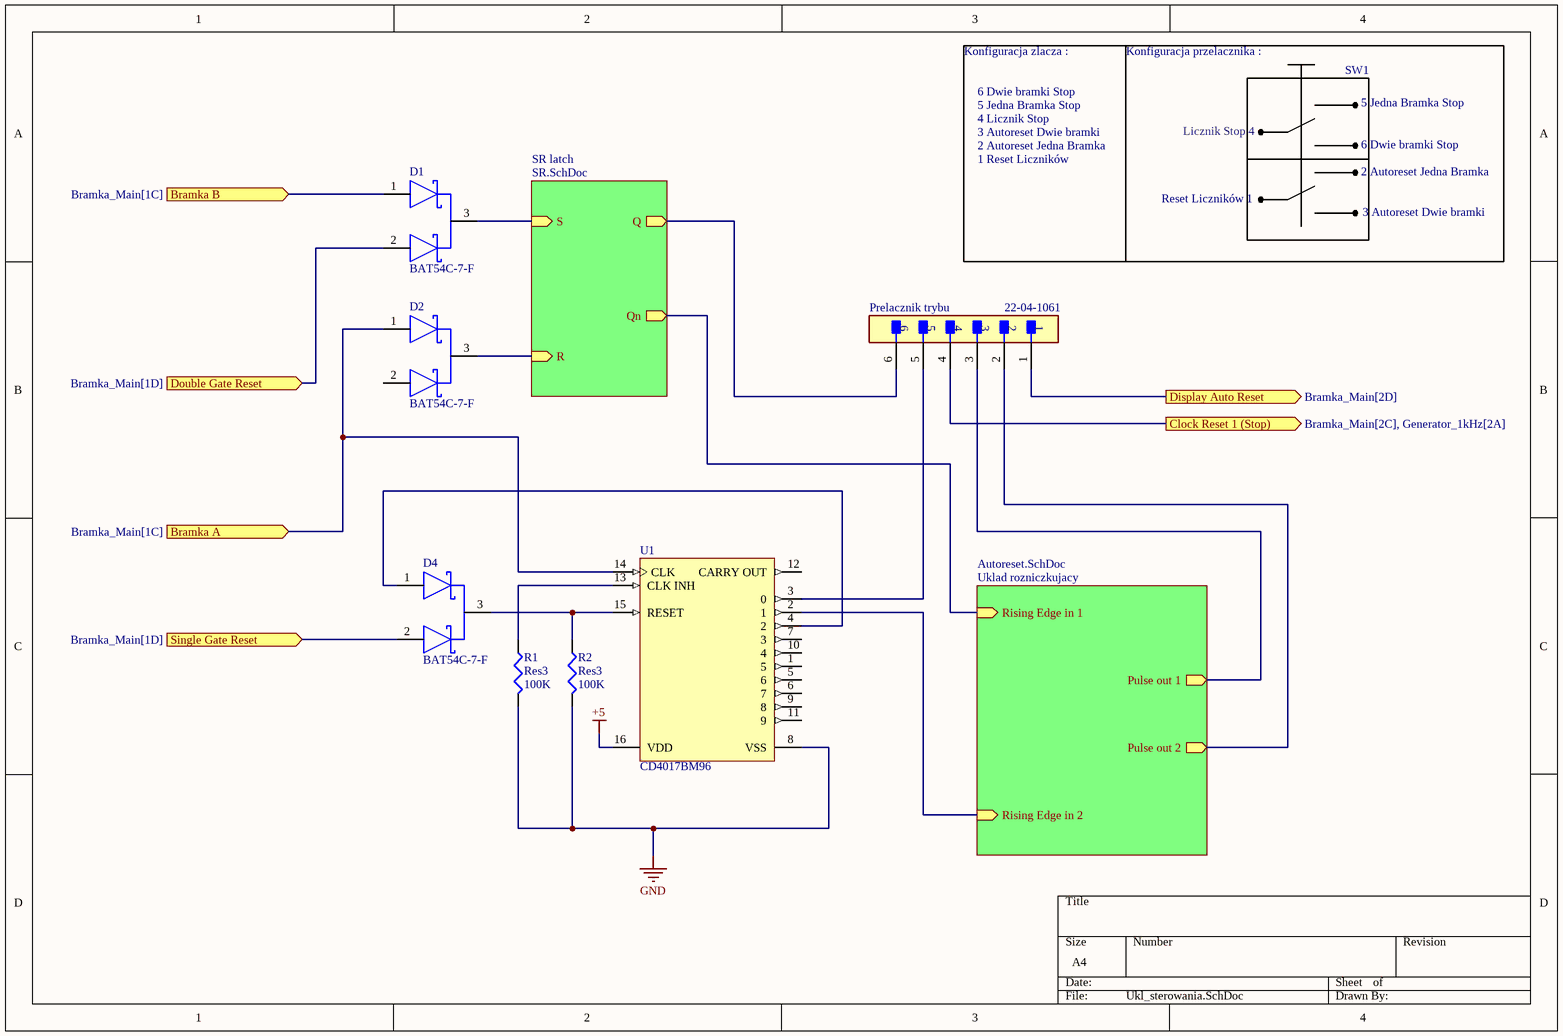
[diagram p5: Ukl_sterowania.SchDoc]

### Parts
D1  BAT54C-7-F  [FP-SOT23-IPC_B]
D2  BAT54C-7-F  [FP-SOT23-IPC_B]
D4  BAT54C-7-F  [FP-SOT23-IPC_B]
Prelacznik_trybu  22-04-1061  [FP-22-04-1061-MFG]
R1  Res3  value 100K  [J1-0603]
R2  Res3  value 100K  [J1-0603]
U1  CD4017BM96  [D0016A_L]

### Sub-sheets
SR latch = SR.SchDoc: S (in), R (in), Q (out), Qn (out)
Uklad rozniczkujacy = Autoreset.SchDoc: Rising Edge in 1 (in), Rising Edge in 2 (in), Pulse out 1 (out), Pulse out 2 (out)

### Ports
Bramka A (in, see Bramka_Main[1C]), Bramka B (in, see Bramka_Main[1C]), Clock Reset 1 (Stop) (out, see Bramka_Main[2C], Generator_1kHz[2A]), Display Auto Reset (out, see Bramka_Main[2D]), Double Gate Reset (in, see Bramka_Main[1D]), Single Gate Reset (in, see Bramka_Main[1D])

### Nets
+5: U1.16(VDD)
GND: R1.2 R2.2 U1.8(VSS)
Display Reset 1: D1.2(2_ANODE) D4.2(2_ANODE) ; port Single Gate Reset, port Double Gate Reset
Display Reset 2: Prelacznik_trybu.1 ; port Display Auto Reset
Q: Prelacznik_trybu.6 ; sheet SR latch/Q
Qn: sheet SR latch/Qn, sheet Uklad rozniczkujacy/Rising Edge in 1
R: D2.3(COMMON_CATHODE) ; sheet SR latch/R
NetBramka_A_1: D2.1(1_ANODE) U1.14(CLK) ; port Bramka A
NetBramka_B_1: D1.1(1_ANODE) ; port Bramka B
NetC5_1: U1.2(1) ; sheet Uklad rozniczkujacy/Rising Edge in 2
NetD1_3: D1.3(COMMON_CATHODE) ; sheet SR latch/S
NetD4_1: D4.1(1_ANODE) U1.4(2)
NetD4_3: D4.3(COMMON_CATHODE) R2.1 U1.15(RESET)
NetD14_1: Prelacznik_trybu.4 ; port Clock Reset 1 (Stop)
NetPrelacznik_trybu_2: Prelacznik_trybu.2 ; sheet Uklad rozniczkujacy/Pulse out 2
NetPrelacznik_trybu_3: Prelacznik_trybu.3 ; sheet Uklad rozniczkujacy/Pulse out 1
NetPrelacznik_trybu_5: Prelacznik_trybu.5 U1.3(0)
NetR1_1: R1.1 U1.13(CLK_INH)

Not connected (* = marked no-connect by the designer): D2 2(2_ANODE); U1 1(5) 5(6) 6(7) 7(3) 9(8) 10(4) 11(9) 12(CARRY_OUT)

### Notes on the sheet
- Konfiguracja zlacza :
- 6 Dwie bramki Stop
- 5 Jedna Bramka Stop
- Konfiguracja przelacznika :
- SW1
- 4 Licznik Stop
- 3 Autoreset Dwie bramki
- 2 Autoreset Jedna Bramka
- 1 Reset Liczników
- Licznik Stop 4
- Reset Liczników 1

### Library data of the parts
D1 D2 D4 = CMP-12790-000084-1: as D14 on sheet Generator_1kHz; Max Operating Temperature: 150°C; Max Reverse Voltage (DC): 30V; Power Rating: 200mW; Termination: SMD/SMT; REACH SVHC: No SVHC; Voltage Rating (DC): 30V; Series: -; Current Rating: 200mA; RoHS Compliant: Yes; Max Power Dissipation: 200mW; Case/Package: SOT-23; Max Repetitive Reverse Voltage (Vrrm): 30V; Width: 1.3mm; Min Operating Temperature: -65°C; Lead Free: Lead Free; Forward Current: 200mA; Number of Pins: 3; Contact Plating: Tin; Package Quantity: 3000; Length: 2.9mm; Radiation Hardening: No; Max Forward Surge Current (Ifsm): 600mA; Height: 1mm; Packaging: Tape and Reel; Mount: Surface Mount; Weight: 0.000282oz
Prelacznik_trybu = CMP-04776-000934-1: CONN HEADER VERT 6POS 2.5MM; Number of Positions: 6; Contact Resistance: 20mR; Insulation Resistance: 1GR; Glow Wire Compliant: Non-compliant; Current Rating: 3A; Max Voltage Rating (DC): 250.25kV; Voltage Rating (AC): 250V; Connector Type: Male Pin; Gender: Male; Hole Diameter: 1.19mm; Termination: Solder; Number of Circuits: 6; Number of Rows: 1; Mount: Through Hole; Lead Free: Lead Free; Contact Type: Male Pin; Lead Pitch: 2.5mm; Radiation Hardening: No; Packaging: Bulk; Pitch: 2.5mm; Contact Plating: Tin; Housing Color: Natural; Fastening Type: Friction; Contact Gender: Male; Length: 14.5mm; Orientation: Straight; Series: KK® 5045; Number of Contacts: 6; Halogen Free: Low Halogen; Min Operating Temperature: -40°C; Number of Poles: 6; Width: 5.8mm; Housing Material: Nylon; Max Operating Temperature: 105°C; Contact Material: Brass; Flammability Rating: UL94 V-0; Color: Natural; Contact Mating Length: 0.295inch; Working Voltage: 250V; Voltage Rating: 250V; Package Quantity: 1; Height: 11.7mm; Voltage Rating (DC): 250V
R1 R2 = Res3: Resistor; Published: 8-Jun-2000; LatestRevisionDate: 29-May-2009; LatestRevisionNote: IPC-7351 Footprint Added.; PackageReference: J1-0603; Publisher: Altium Limited; PackageDescription: Chip Resistor
U1 = CMP-1623-00072-2: as U6 on sheet Licznik_sekund; Output Type: CMOS; Operating Temperature Range(C): -55 to 125; Generic Part Number: CD4017B; Type: Decade; DatasheetVersion: SCHS027C; Input Type: CMOS; Function: Counter; PackageReference: D0016A; Code_JEDEC: MS-012 variation AC; Voltage(Nom)(V): 10

## Sheet SR.SchDoc
size A4; SheetNumber: 6; SheetTotal: 7
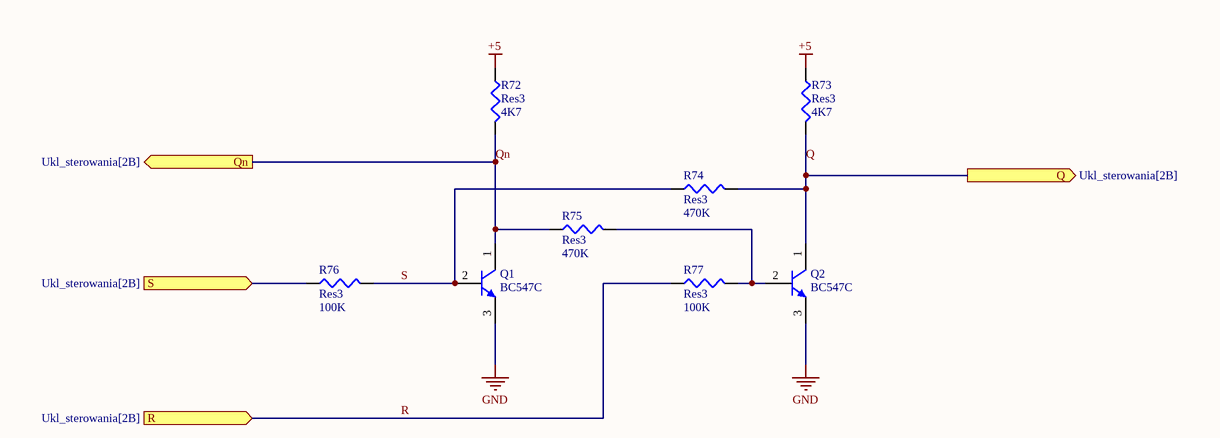
[diagram p6: SR.SchDoc]

### Parts
Q1  BC547C  [ONSC-TO-92-3-29-11]
Q2  BC547C  [ONSC-TO-92-3-29-11]
R72  Res3  value 4K7  [J1-0603]
R73  Res3  value 4K7  [J1-0603]
R74  Res3  value 470K  [J1-0603]
R75  Res3  value 470K  [J1-0603]
R76  Res3  value 100K  [J1-0603]
R77  Res3  value 100K  [J1-0603]

### Ports
Q (out, see Ukl_sterowania[2B]), Qn (out, see Ukl_sterowania[2B]), R (in, see Ukl_sterowania[2B]), S (in, see Ukl_sterowania[2B])

### Nets
+5: R72.1 R73.1
GND: Q1.3(E) Q2.3(E)
Q: Q2.1(C) R73.2 R74.2 ; port Q
Qn: Q1.1(C) R72.2 R75.1 ; port Qn
R: R77.1 ; port R
S: Q1.2(B) R74.1 R76.2
NetD1_3: R76.1 ; port S
NetQ2_2: Q2.2(B) R75.2 R77.2

### Library data of the parts
Q1 Q2 = CMP-1048-01437-1: Amplifier Transistor, NPN Silicon, 3-Pin TO-92, Bulk Box; Manufacturer: On Semiconductor; IC Continuous (A): 0.1; fT Min (MHz): 150; Mounting Technology: Through Hole; ComponentLink1URL: http://www.onsemi.com/; ComponentLink1Description: Manufacturer URL; ComponentLink3URL: http://www.onsemi.cn/pub_link/Collateral/2N6426-D.PDF; DatasheetVersion: Rev. 7; PackageVersion: Rev. AM; Packing: Bulk Box; RoHS: FALSE; Polarity: NPN; PartNumber: BC547C; ComponentLink2URL: http://www.onsemi.com/pub_link/Collateral/BC546-D.PDF; ComponentLink3Description: Package Specification; PackageDescription: 3-Pin Transistor Outline, Body 4.825 x 3.685 mm, Pitch 1.27 mm; PackageReference: TO-92-3-29-11_AM_SL; ComponentLink2Description: Datasheet
R72-R77 = Res3: Resistor; Published: 8-Jun-2000; LatestRevisionDate: 29-May-2009; LatestRevisionNote: IPC-7351 Footprint Added.; PackageReference: J1-0603; Publisher: Altium Limited; PackageDescription: Chip Resistor

## Sheet Autoreset.SchDoc
size A4; SheetNumber: 6; SheetTotal: 7
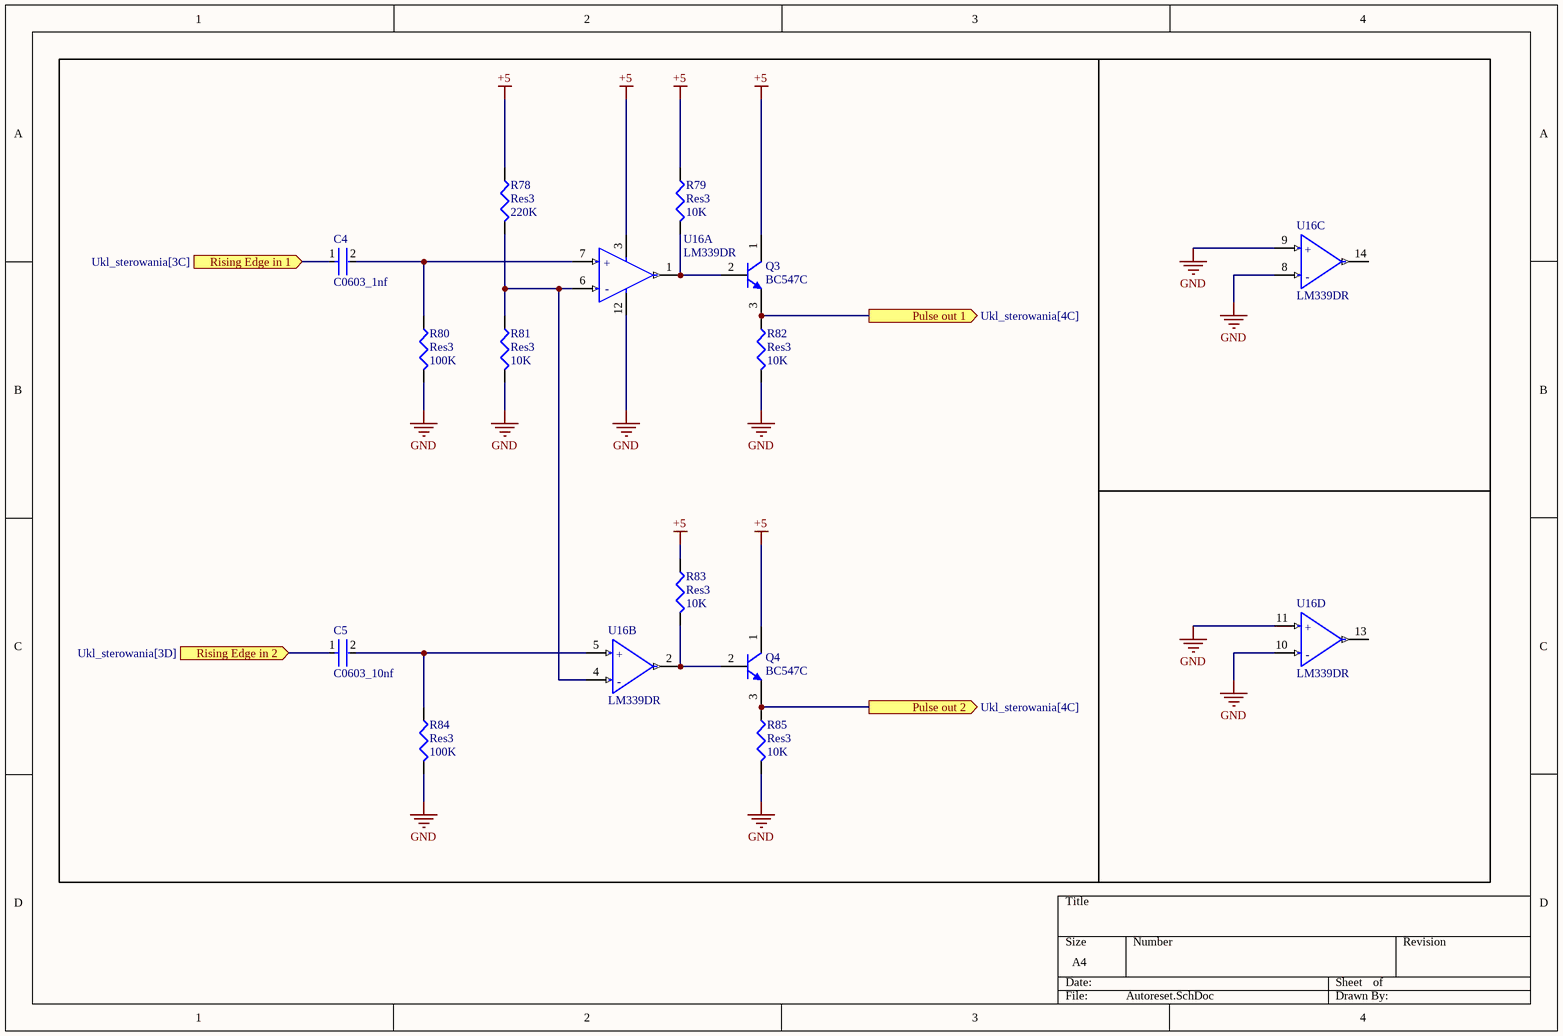
[diagram p7: Autoreset.SchDoc]

### Parts
C4  C0603_1nf  [FP-C0603C-CF-MFG]
C5  C0603_10nf  [FP-C0603C-CF-MFG]
Q3  BC547C  [ONSC-TO-92-3-29-11]
Q4  BC547C  [ONSC-TO-92-3-29-11]
R78  Res3  value 220K  [J1-0603]
R79  Res3  value 10K  [J1-0603]
R80  Res3  value 100K  [J1-0603]
R81  Res3  value 10K  [J1-0603]
R82  Res3  value 10K  [J1-0603]
R83  Res3  value 10K  [J1-0603]
R84  Res3  value 100K  [J1-0603]
R85  Res3  value 10K  [J1-0603]
U16  LM339DR  [FP-D0014A-MFG]  (parts A,B,C,D of 4)

### Ports
Pulse out 1 (out, see Ukl_sterowania[4C]), Pulse out 2 (out, see Ukl_sterowania[4C]), Rising Edge in 1 (in, see Ukl_sterowania[3C]), Rising Edge in 2 (in, see Ukl_sterowania[3D])

### Nets
+5: Q3.1(C) Q4.1(C) R78.1 R79.1 R83.1 U16.3(VCC)
GND: R80.2 R81.2 R82.2 R84.2 R85.2 U16.8(3IN-) U16.9(3IN+) U16.10(4IN-) U16.11(4IN+) U16.12(GND)
Qn: C4.1 ; port Rising Edge in 1
NetC4_2: C4.2 R80.1 U16.7(1IN+)
NetC5_1: C5.1 ; port Rising Edge in 2
NetC5_2: C5.2 R84.1 U16.5(2IN+)
NetPrelacznik_trybu_2: Q4.3(E) R85.1 ; port Pulse out 2
NetPrelacznik_trybu_3: Q3.3(E) R82.1 ; port Pulse out 1
NetQ3_2: Q3.2(B) R79.2 U16.1(1OUT)
NetQ4_2: Q4.2(B) R83.2 U16.2(2OUT)
NetR78_2: R78.2 R81.1 U16.4(2IN-) U16.6(1IN-)

Not connected (* = marked no-connect by the designer): U16 13(OUT4) 14(OUT3)

### Notes on the sheet
- (in symbol CMP-04896-000028-1, part A) +; -
- (in symbol CMP-04896-000028-1, part B) +; -
- (in symbol CMP-04896-000028-1, part C) +; -
- (in symbol CMP-04896-000028-1, part D) +; -

### Library data of the parts
C4 C5 = CMP-1035-00914-3: as C3 on sheet Bramka_Main; ComponentLink2URL: https://api.kemet.com/component-edge/download/datasheet/C0603C100J5GACAUTO.pdf; Automotive: Yes; Device Class L2: Capacitors; Device Class L1: Passive Components; Device Class L3: Ceramic Capacitors; RoHS: TRUE; Octopart: https://octopart.com/c0603c300j5gactu-kemet-199455; Lead Free: Yes; Value: 30 pF; Temperature Range High: +125°C; Category: Cap; Temperature: -55°C to +125°C; Package: C0603C-CF; Capacitance: 30 pF; Digikey Description: CAP CER 30PF 50V 5% NP0 0603; Height: 0.87mm; ComponentLink2Description: Datasheet; Temperature Range Low: -55°C; Mouser Description: Multilayer Ceramic Capacitors MLCC - SMD/SMT 50volts 30pF C0G 5%; Voltage Rating: 50 V
Q3 Q4 = CMP-1048-01437-1: as Q1 on sheet SR; Mounting Technology: Through Hole; ComponentLink1URL: http://www.onsemi.com/; ComponentLink1Description: Manufacturer URL; ComponentLink3URL: http://www.onsemi.cn/pub_link/Collateral/2N6426-D.PDF; DatasheetVersion: Rev. 7; PackageVersion: Rev. AM; Packing: Bulk Box; RoHS: FALSE; Polarity: NPN; PartNumber: BC547C; ComponentLink2URL: http://www.onsemi.com/pub_link/Collateral/BC546-D.PDF; ComponentLink3Description: Package Specification; PackageDescription: 3-Pin Transistor Outline, Body 4.825 x 3.685 mm, Pitch 1.27 mm; PackageReference: TO-92-3-29-11_AM_SL; ComponentLink2Description: Datasheet
R78-R85 = Res3: Resistor; Published: 8-Jun-2000; LatestRevisionDate: 29-May-2009; LatestRevisionNote: IPC-7351 Footprint Added.; PackageReference: J1-0603; Publisher: Altium Limited; PackageDescription: Chip Resistor
U16 = CMP-04896-000028-1: IC QUAD DIFF COMP 14-SOIC; Manufacturer: Texas Instruments; Nominal Supply Current: 0.8mA; Min Dual Supply Voltage: 1V; Number Of Channels: 4; Input Offset Voltage: 2mV; Max Junction Temp: +70°C; Min Supply Voltage: 2V; Response Time: 1.3us; Max Dual Supply Voltage: 18V; Max Supply Voltage: 30V; Standoff Height: 0.1mm; Input Bias Current: -0.025uA; Output Current Per Channel: 6mA; Category: IC; Octopart: https://octopart.com/lm339dr-texas+instruments-45532; Automotive: No; Temperature: 0°C to +70°C; Ipc Land Pattern Name: SOIC127P600X175-14; Temperature Range Low: 0°C; Mouser Description: Analog Comparators Quad Differential; Lead Free: Yes; Digikey Description: IC QUAD DIFF COMP 14-SOIC; ComponentLink2URL: http://www.ti.com/lit/ds/symlink/lm339.pdf; Device Class L3: Comparators; Manufacturer Part Number: LM339DR; Temperature Range High: +70°C; Device Class L2: Linear ICs; Height: 1.75mm; Device Class L1: Integrated Circuits (ICs); Package: D0014A; RoHS: TRUE; ComponentLink2Description: Datasheet

## Nets that join several sheets
+5: Bramka_Main (6 pins), Generator_1kHz (U15.16), Licznik_mili_sekund (14 pins), Licznik_sekund (11 pins), Licznik_minut (DISP3.1 DISP3.5 U7.3 U7.16), Ukl_sterowania (U1.16), SR (R72.1 R73.1), Autoreset (6 pins)
GND: Bramka_Main (Bramka_A.3 Bramka_B.3 C3.2 Zasilanie.1), Generator_1kHz (C1.2 C2.2 R71.2 U15.8), Licznik_mili_sekund (14 pins), Licznik_sekund (13 pins), Licznik_minut (R34.2 R35.2 U7.8 U8.8), Ukl_sterowania (R1.2 R2.2 U1.8), SR (Q1.3 Q2.3), Autoreset (10 pins)
1Hz: Licznik_mili_sekund (U13.5), Licznik_sekund (U2.1)
Display Reset 1: Bramka_Main (C3.1 Reset_Na_panel.1), Licznik_mili_sekund (D11.2 D12.2 D13.2), Licznik_sekund (D5.1 D7.1 D8.1), Licznik_minut (D10.1), Ukl_sterowania (D1.2 D4.2)
Display Reset 2: Licznik_mili_sekund (D11.1 D12.1 D13.1), Licznik_sekund (D6.1 D9.1), Licznik_minut (D10.2), Ukl_sterowania (Prelacznik_trybu.1)
NetBramka_A_1: Bramka_Main (Bramka_A.1 Bramka_A_test.1), Ukl_sterowania (D2.1 U1.14)
NetBramka_B_1: Bramka_Main (Bramka_B.1 Bramka_B_test.1), Ukl_sterowania (D1.1)
NetC5_1: Ukl_sterowania (U1.2), Autoreset (C5.1)
NetD1_3: Ukl_sterowania (D1.3), SR (R76.1)
NetD14_1: Generator_1kHz (D14.1), Ukl_sterowania (Prelacznik_trybu.4)
NetPrelacznik_trybu_2: Ukl_sterowania (Prelacznik_trybu.2), Autoreset (Q4.3 R85.1)
NetPrelacznik_trybu_3: Ukl_sterowania (Prelacznik_trybu.3), Autoreset (Q3.3 R82.1)
NetU4_5: Licznik_sekund (U4.5), Licznik_minut (U7.1)
NetU9_1: Generator_1kHz (U15.1), Licznik_mili_sekund (U9.1)
Q: Ukl_sterowania (Prelacznik_trybu.6), SR (Q2.1 R73.2 R74.2)
Qn: SR (Q1.1 R72.2 R75.1), Autoreset (C4.1)
R: Ukl_sterowania (D2.3), SR (R77.1)